# Altium project ESCV03.PrjPcb
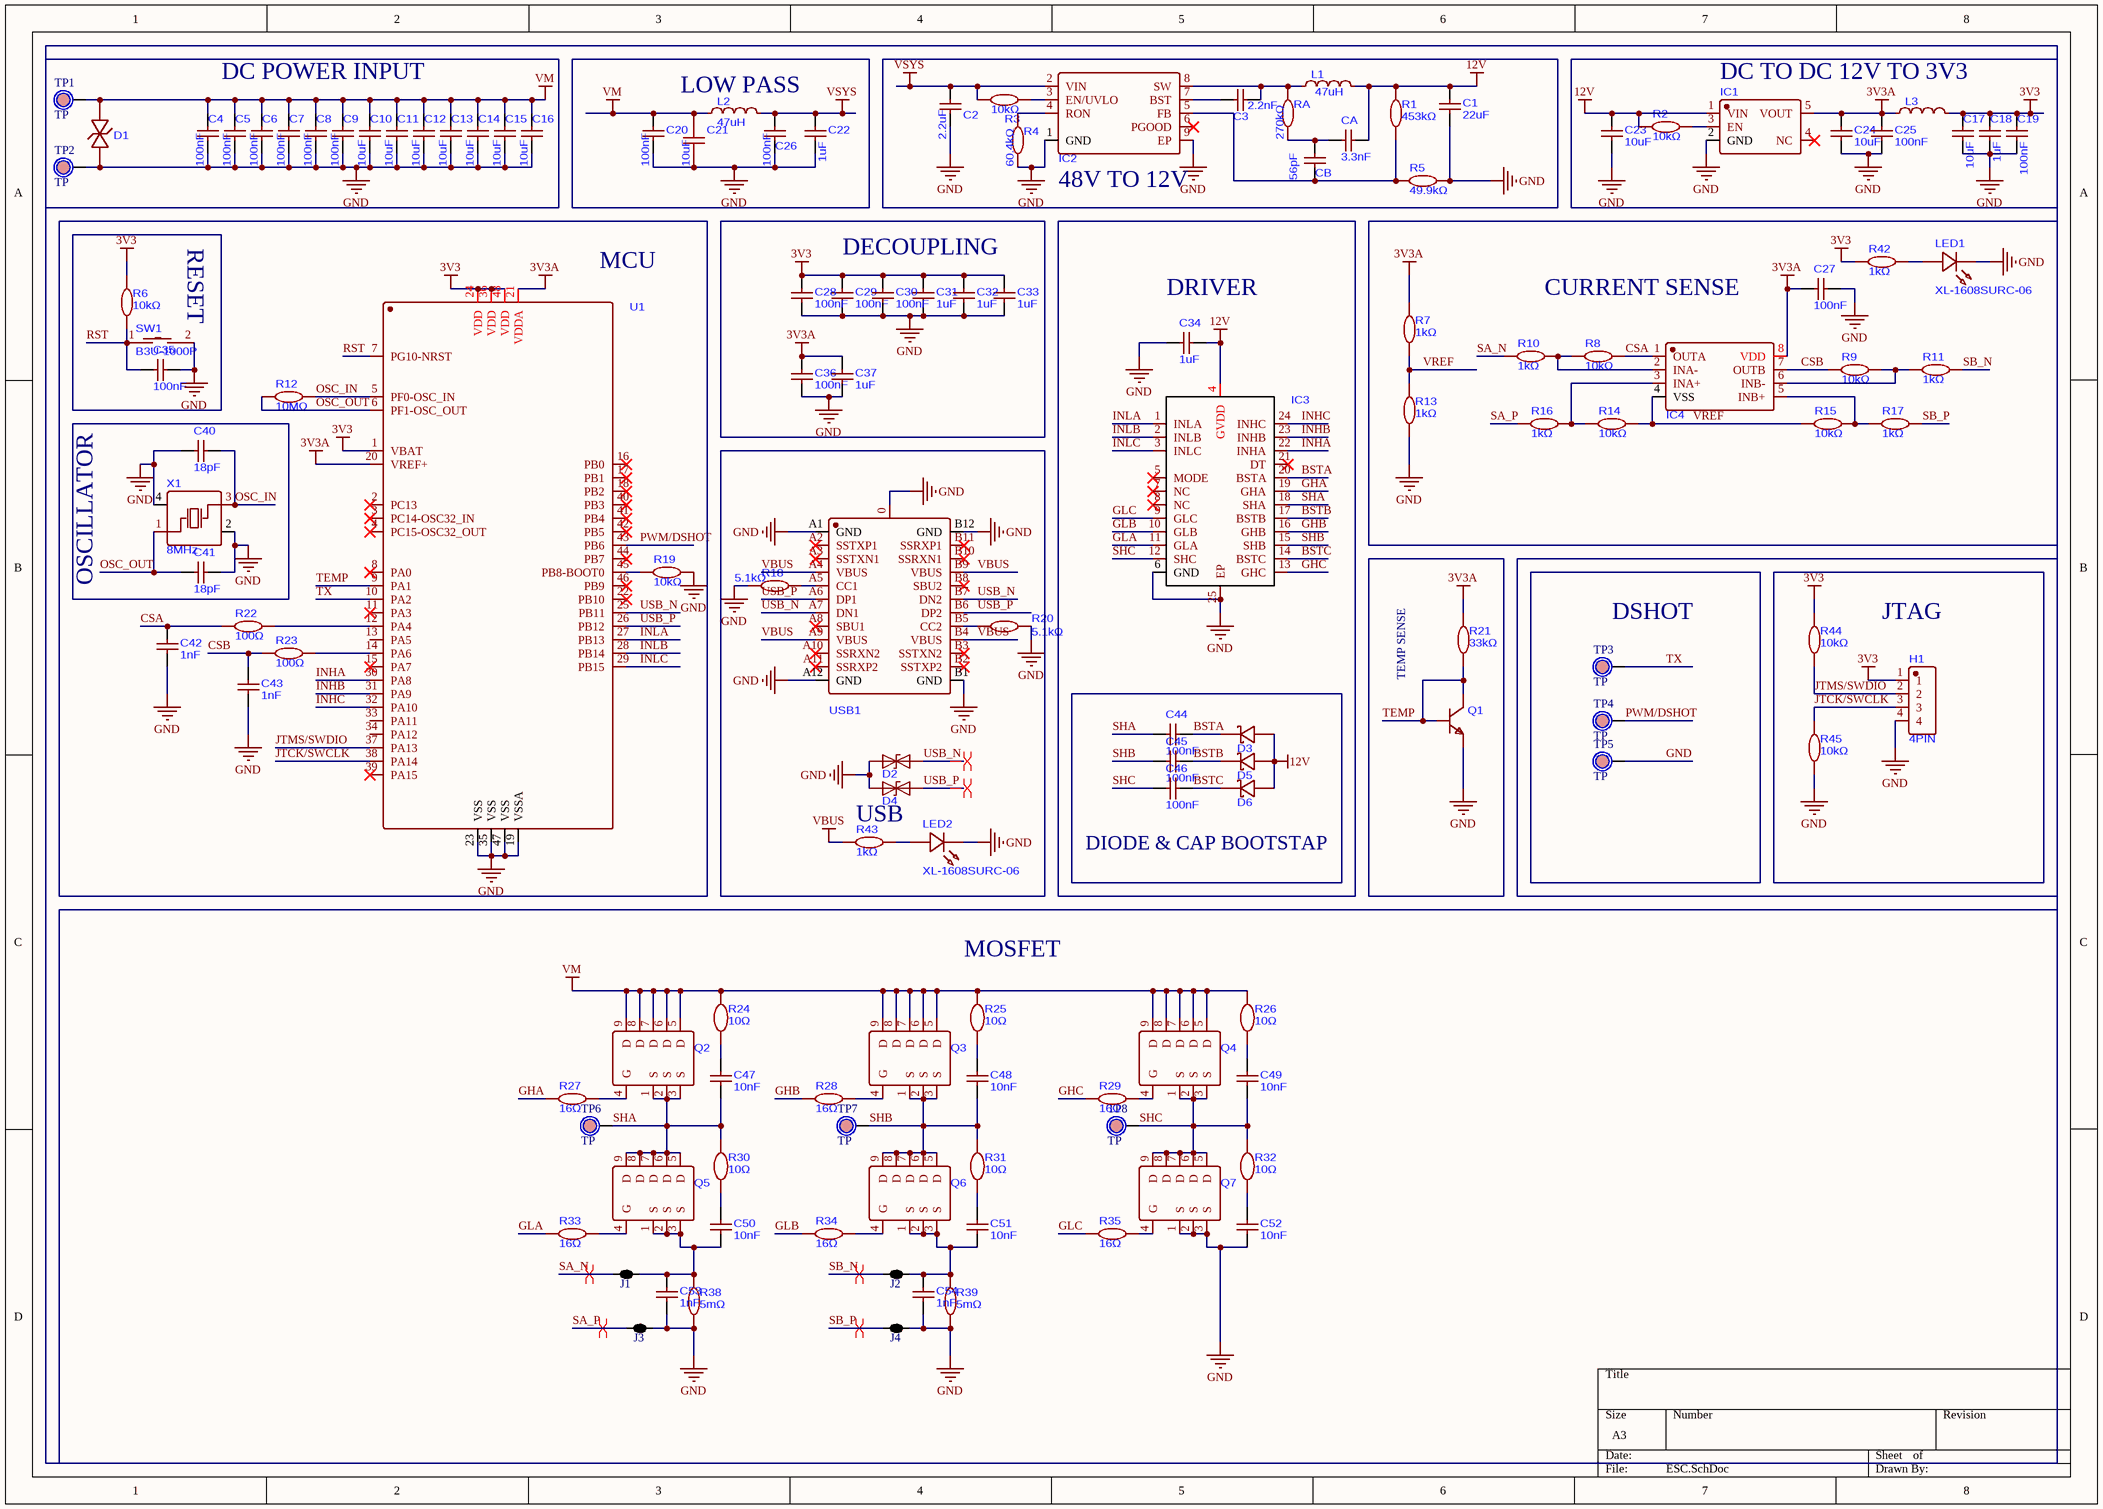
[diagram p0: ESC.SchDoc]
1 sheet, 135 parts. Net scope: global (net labels, ports and power ports of the same name join across sheets).
Board file: ESC.PcbDoc

## Sheet ESC.SchDoc
size A3; SheetNumber: 1; SheetTotal: 1; SPICEModelCacheRRHQRJVO: <root> / <DocumentId>RRHQRJVO</DocumentId> / <CacheFrame Number="0"> / <Model Name="spx3819" Kind="CKT"> / <Text>.SUBCKT SPX3819 VIN VOUT GND EN / * PARAMETERS / .PARAM VREF=3.3 / .PARAM VDROP=0.34 / .PARAM ILIM=0.9 / .PARAM ROUT=0.05 / * Enable logic (EN &gt; 1V) / EEN VEN 0 VALUE = { V(EN) &gt; 1 } / * Regulator core (with dropout) / EREG VREG 0 VALUE = { V(VEN)*LIMIT(V(VIN)-VDROP, 0, VREF) } / * Output resistance / Rout VREG VOUT {ROUT} / * Current sense / Rsense VOUT VSENSE 0.01 / * Current limit clamp / GCLAMP VOUT 0 VALUE = { / IF(I(Rsense) &gt; ILIM, -(I(Rsense)-ILIM)*5, 0) / } / * Ground reference / RGND GND 0 1m / .ENDS SPX3819</Text> / </Model> / <Model Name="fb_220_adv" Kind="CKT"> / <Text>.SUBCKT FB_220_ADV 1 2 / Rdc 1 2 0.045 / * low freq inductive / L1 1 3 50n / R1 3 2 1 / * high freq loss / R2 1 2 200 / Cpar 1 2 2p / .ends FB_220_ADV</Text> / </Model> / <Model Name="mmbt3904" Kind="CKT"> / <Text>* SPICE model NPN bipolar transistor ***MMBT3904*** / * Use the symbol file ***mmbt3904.asy*** / * / * (c) Diotec Semiconductor AG / * www.diotec.com / * 2024-10-15 / * / ********************************************************* / * This model is for simulation purposes only. It does   * / * not replace reviewing of the data sheet nor real life * / * testing of the part inside the application.           * / ********************************************************* / * / .subckt MMBT3904 C  B  E  params: Vceo=40 Vcbo=60 Vebo=6 Ic=200m hfe=300 Ices=100n Vbe=700m ft=300Meg Ccbo=4p Cebo=8p Rc=1 Rb=.1 Re=.1 Eg=1.11 Xti=3 / * Above values are an example for the ***MMBT3904***. Using the / * above symbol file allows for direct insertion of other values / * according to these data sheet parameters: / * / * Vceo    	Collector Emitter voltage, Base open / * Vcbo		Collector Base voltage, Emitter open / * Vebo    	Emitter Base voltage, Collector open / * Ic		DC Collector current / * hfe		Max DC current gain / * Ices		Collector Emitter cut-off current / * Vbe		Min Base Emitter voltage / * ft		Gain bandwidth product / * Ccbo		Typ. Collector Base capacitance / * Cebo		Typ. Emitter Base capacitance / * Rc/Rb/Re	Fixed values / * / * Activation energy: Eg=1.11 for Si (npn) transistor / * Sat.-current temp. exp: Xti=3 for Si (npn) transistor / Q  C B E  Transistor / .model Transistor NPN(Is={Ices/2} Bf={hfe} Bvcbo={Vcbo} Bvbe={-Vebo} Vceo={Vceo} Vje={Vbe} Tf={1/(2*pi*ft)} Eg={Eg} Xti={Xti} Icrating={Ic} Cjc={Ccbo*2} Cje={Cebo*2} Rc={Rc} Rb={Rb} Re={Re} mfg=Diotec) / .ends</Text> / </Model> / </CacheFrame> / </root>

### Parts
C1  22uF  [C0603]
C2  2.2uF  [C0805]
C3  2.2nF  [C0402]
C4  100nF  [C0805]
C5  100nF  [C0805]
C6  100nF  [C0805]
C7  100nF  [C0805]
C8  100nF  [C0805]
C9  100nF  [C0805]
C10  10uF  [C1206]
C11  10uF  [C1206]
C12  10uF  [C1206]
C13  10uF  [C1206]
C14  10uF  [C1206]
C15  10uF  [C1206]
C16  10uF  [C1206]
C17  10uF  [C0603]
C18  1uF  [C0603]
C19  100nF  [C0603]
C20  100nF  [C0805]
C21  10uF  [C1206]
C22  1uF  [C0603]
C23  10uF  [C0603]
C24  10uF  [C0603]
C25  100nF  [C0603]
C26  100nF  [C0805]
C27  100nF  [C0402]
C28  100nF  [C0402]
C29  100nF  [C0402]
C30  100nF  [C0402]
C31  1uF  [C0402]
C32  1uF  [C0402]
C33  1uF  [C0402]
C34  1uF  [C0402]
C35  100nF  [C0402]
C36  100nF  [C0402]
C37  1uF  [C0402]
C40  18pF  [C0402]
C41  18pF  [C0402]
C42  1nF  [C0402]
C43  1nF  [C0402]
C44  100nF  [C0402]
C45  100nF  [C0402]
C46  100nF  [C0402]
C47  10nF  [C1206]
C48  10nF  [C1206]
C49  10nF  [C1206]
C50  10nF  [C1206]
C51  10nF  [C1206]
C52  10nF  [C1206]
C53  1nF  [C0402]
C54  1nF  [C0402]
CA  3.3nF  [C0603]
CB  56pF  [C0603]
D1  TVS DIODE 58VWM 85VC SMB  [DO-214AA_L4.4-W3.6-LS5.3-RD]  (value not drawn)
D2  TVS DIODE 5VWM 18.6VC SOD-523  [SOD-523_L1.2-W0.8-LS1.6-BI]  (value not drawn)
D3  DIODE SCHOTTKY 100V SOD-123FL  [SOD-123FL_L2.7-W1.8-LS3.8-RD]  (value not drawn)
D4  TVS DIODE 5VWM 18.6VC SOD-523  [SOD-523_L1.2-W0.8-LS1.6-BI]  (value not drawn)
D5  DIODE SCHOTTKY 100V SOD-123FL  [SOD-123FL_L2.7-W1.8-LS3.8-RD]  (value not drawn)
D6  DIODE SCHOTTKY 100V SOD-123FL  [SOD-123FL_L2.7-W1.8-LS3.8-RD]  (value not drawn)
H1  4PIN  [HDR-TH_4P-P1.27-V-M]
IC1  500mA Low-Noise LDo Voltage Regulator  [SOT-23-5_L2.9-W1.6-P0.95-LS2.8-BR]  (value not drawn)
IC2  100-V Input, 1-A Synchronous Buck DC/DC Converter  [SO-8_L4.9-W3.9-P1.27-LS6.0-BL-EP]  (value not drawn)
IC3  100V three-phase BLDC gate driver  [QFN-24_L4.0-W4.0-P0.50-BL-EP2.7]  (value not drawn)
IC4  Zero-Drift CMOS Rail-to-Rail I/O Opamp with RF Filter  [MSOP-8_L3.0-W3.0-P0.65-LS5.0-BL]  (value not drawn)
J1  2 way net tie junction  [2way_LP]  (value not drawn)  (net tie, no BOM)
J2  2 way net tie junction  [2way_LP]  (value not drawn)  (net tie, no BOM)
J3  2 way net tie junction  [2way_LP]  (value not drawn)  (net tie, no BOM)
J4  2 way net tie junction  [2way_LP]  (value not drawn)  (net tie, no BOM)
L1  47uH  [IND-SMD_L6.0-W6.0]
L2  47uH  [IND-SMD_L5.0-W5.0_FNR50XXS]
L3  FERRITE BEAD 120Ω 0603 1LN  [C0603]  (value not drawn)
LED1  XL-1608SURC-06  [LED0603-RD_RED]
LED2  XL-1608SURC-06  [LED0603-RD_RED]
Q1  TRANS NPN 40V 200mA SOT-416  [SC-75-3_L1.6-W0.8-P1.00-LS1.6-BR]  (value not drawn)
Q2  MOSFET N-CH 85V 170A PDFN5x6-8L  [PDFN-8_L5.8-W5.1-P1.27-LS6.1-BL]  (value not drawn)
Q3  MOSFET N-CH 85V 170A PDFN5x6-8L  [PDFN-8_L5.8-W5.1-P1.27-LS6.1-BL]  (value not drawn)
Q4  MOSFET N-CH 85V 170A PDFN5x6-8L  [PDFN-8_L5.8-W5.1-P1.27-LS6.1-BL]  (value not drawn)
Q5  MOSFET N-CH 85V 170A PDFN5x6-8L  [PDFN-8_L5.8-W5.1-P1.27-LS6.1-BL]  (value not drawn)
Q6  MOSFET N-CH 85V 170A PDFN5x6-8L  [PDFN-8_L5.8-W5.1-P1.27-LS6.1-BL]  (value not drawn)
Q7  MOSFET N-CH 85V 170A PDFN5x6-8L  [PDFN-8_L5.8-W5.1-P1.27-LS6.1-BL]  (value not drawn)
R1  453kΩ  [R0603]
R2  10kΩ  [R0603]
R3  10kΩ  [R0603]
R4  60.4kΩ  [R0603]
R5  49.9kΩ  [R0603]
R6  10kΩ  [R0402]
R7  1kΩ  [R0402]
R8  10kΩ  [R0402]
R9  10kΩ  [R0402]
R10  1kΩ  [R0402]
R11  1kΩ  [R0402]
R12  10MΩ  [R0402]
R13  1kΩ  [R0402]
R14  10kΩ  [R0402]
R15  10kΩ  [R0402]
R16  1kΩ  [R0402]
R17  1kΩ  [R0402]
R18  5.1kΩ  [R0402]
R19  10kΩ  [R0402]
R20  5.1kΩ  [R0402]
R21  33kΩ  [R0402]
R22  100Ω  [R0402]
R23  100Ω  [R0402]
R24  10Ω  [R0612]
R25  10Ω  [R0612]
R26  10Ω  [R0612]
R27  16Ω  [R0402]
R28  16Ω  [R0402]
R29  16Ω  [R0402]
R30  10Ω  [R0612]
R31  10Ω  [R0612]
R32  10Ω  [R0612]
R33  16Ω  [R0402]
R34  16Ω  [R0402]
R35  16Ω  [R0402]
R38  5mΩ  [R2512]
R39  5mΩ  [R2512]
R42  1kΩ  [R0402]
R43  1kΩ  [R0402]
R44  10kΩ  [R0402]
R45  10kΩ  [R0402]
RA  270kΩ  [R0603]
SW1  B3U-1000P  [KEY-SMD_B3U-1000PM]
TP1  TP  [PAD]
TP2  TP  [PAD]
TP3  TP  [PAD]
TP4  TP  [PAD]
TP5  TP  [PAD]
TP6  TP  [PAD]
TP7  TP  [PAD]
TP8  TP  [PAD]
U1  Arm Cortex-M4 32-bit MCU+FPU, 170 MHz / 213 DMIPS, up to 128 KB Flash, 32 KB SRAM, rich analog, math accelerator  [LQFP-48_L7.0-W7.0-P0.50-LS9.0-BL]  (value not drawn)
USB1  CONN RCPT Type-C 24POS SMD  [USB-C-SMD_U263-241N-4BQC14]  (value not drawn)
X1  8MHz  [OSC-SMD_4P-L5.0-W3.2-BL]

### Nets
3V3: C17.2 C18.2 C19.2 C28.2 C29.2 C30.2 C31.2 C32.2 C33.2 H1.1 L3.2 R6.2 R42.1 R44.2 U1.1(VBAT) U1.24(VDD) U1.36(VDD) U1.48(VDD)
3V3A: C24.2 C25.2 C27.2 C36.2 C37.2 IC1.5(VOUT) IC4.8(VDD) L3.1 R7.2 R21.2 U1.20(VREF+) U1.21(VDDA)
12V: C1.2 C23.2 C34.2 CA.2 D3.2 D5.2 D6.2 IC1.1(VIN) IC3.4(GVDD) L1.2 R1.2 R2.1
GND: C1.1 C2.1 C4.1 C5.1 C6.1 C7.1 C8.1 C9.1 C10.1 C11.1 C12.1 C13.1 C14.1 C15.1 C16.1 C17.1 C18.1 C19.1 C20.1 C21.1 C22.1 C23.1 C24.1 C25.1 C26.1 C27.1 C28.1 C29.1 C30.1 C31.1 C32.1 C33.1 C34.1 C35.2 C36.1 C37.1 C40.1 C41.2 C42.1 C43.1 C52.1 C53.1 C54.1 D1.1 D2.1(K) D4.1(K) H1.4 IC1.2(GND) IC2.1(GND) IC2.9(EP) IC3.6(GND) IC3.25(EP) J3.2 J4.2 LED1.1(K) LED2.1(K) Q1.2(E) Q7.1(S) Q7.2(S) Q7.3(S) R4.1 R5.2 R13.1 R18.1 R19.2 R20.2 R38.1 R39.1 R45.1 SW1.2 TP2.1 TP5.1 U1.19(VSSA) U1.23(VSS) U1.35(VSS) U1.47(VSS) USB1.0(SHELL) USB1.A1(GND) USB1.A12(GND) USB1.B1(GND) USB1.B12(GND) X1.2(GND) X1.4(GND)
VBUS: R43.1 USB1.A4(VBUS) USB1.A9(VBUS) USB1.B4(VBUS) USB1.B9(VBUS)
VM: C4.2 C5.2 C6.2 C7.2 C8.2 C9.2 C10.2 C11.2 C12.2 C13.2 C14.2 C15.2 C16.2 C20.2 C21.2 D1.2 L2.1 Q2.5(D) Q2.6(D) Q2.7(D) Q2.8(D) Q2.9(D) Q3.5(D) Q3.6(D) Q3.7(D) Q3.8(D) Q3.9(D) Q4.5(D) Q4.6(D) Q4.7(D) Q4.8(D) Q4.9(D) R24.2 R25.2 R26.2 TP1.1
VSYS: C2.2 C22.2 C26.2 IC2.2(VIN) L2.2 R3.1
BSTA: C44.2 D3.1 IC3.20(BSTA)
BSTB: C45.2 D5.1 IC3.17(BSTB)
BSTC: C46.2 D6.1 IC3.14(BSTC)
CSA: C42.2 IC4.1(OUTA) R8.2 R22.1
CSB: C43.2 IC4.7(OUTB) R9.1 R23.1
GHA: IC3.19(GHA) R27.1
GHB: IC3.16(GHB) R28.1
GHC: IC3.13(GHC) R29.1
GLA: IC3.11(GLA) R33.1
GLB: IC3.10(GLB) R34.1
GLC: IC3.9(GLC) R35.1
INHA: IC3.22(INHA) U1.30(PA8)
INHB: IC3.23(INHB) U1.31(PA9)
INHC: IC3.24(INHC) U1.32(PA10)
INLA: IC3.1(INLA) U1.27(PB13)
INLB: IC3.2(INLB) U1.28(PB14)
INLC: IC3.3(INLC) U1.29(PB15)
JTCK/SWCLK: H1.3 R45.2 U1.38(PA14)
JTMS/SWDIO: H1.2 R44.1 U1.37(PA13)
OSC_IN: C40.2 R12.2 U1.5(PF0-OSC_IN) X1.3(OSC2)
OSC_OUT: C41.1 R12.1 U1.6(PF1-OSC_OUT) X1.1(OSC1)
PWM/DSHOT: TP4.1 U1.43(PB6)
RST: C35.1 R6.1 SW1.1 U1.7(PG10-NRST)
SA_N: J1.1 R10.1
SA_P: J3.1 R16.1
SB_N: J2.1 R11.2
SB_P: J4.1 R17.2
SHA: C44.1 C47.1 IC3.18(SHA) Q2.1(S) Q2.2(S) Q2.3(S) Q5.5(D) Q5.6(D) Q5.7(D) Q5.8(D) Q5.9(D) R30.2 TP6.1
SHB: C45.1 C48.1 IC3.15(SHB) Q3.1(S) Q3.2(S) Q3.3(S) Q6.5(D) Q6.6(D) Q6.7(D) Q6.8(D) Q6.9(D) R31.2 TP7.1
SHC: C46.1 C49.1 IC3.12(SHC) Q4.1(S) Q4.2(S) Q4.3(S) Q7.5(D) Q7.6(D) Q7.7(D) Q7.8(D) Q7.9(D) R32.2 TP8.1
TEMP: Q1.1(B) Q1.3(C) R21.1 U1.9(PA1)
TX: TP3.1 U1.10(PA2)
USB_N: D2.2(A) U1.25(PB11) USB1.A7(DN1) USB1.B7(DN2)
USB_P: D4.2(A) U1.26(PB12) USB1.A6(DP1) USB1.B6(DP2)
VREF: IC4.4(VSS) R7.1 R13.2 R14.2 R15.1
NetC3_1: C3.1 IC2.8(SW) L1.1 RA.2
NetC3_2: C3.2 IC2.7(BST)
NetC47_2: C47.2 R24.1
NetC48_2: C48.2 R25.1
NetC49_2: C49.2 R26.1
NetC50_1: C50.1 C53.2 J1.2 Q5.1(S) Q5.2(S) Q5.3(S) R38.2
NetC50_2: C50.2 R30.1
NetC51_1: C51.1 C54.2 J2.2 Q6.1(S) Q6.2(S) Q6.3(S) R39.2
NetC51_2: C51.2 R31.1
NetC52_2: C52.2 R32.1
NetCA_1: CA.1 CB.2 RA.1
NetCB_1: CB.1 IC2.5(FB) R1.1 R5.1
NetIC1_3: IC1.3(EN) R2.2
NetIC2_3: IC2.3(EN/UVLO) R3.2
NetIC2_4: IC2.4(RON) R4.2
NetIC4_2: IC4.2(INA-) R8.1 R10.2
NetIC4_3: IC4.3(INA+) R14.1 R16.2
NetIC4_5: IC4.5(INB+) R15.2 R17.1
NetIC4_6: IC4.6(INB-) R9.2 R11.1
NetLED1_2: LED1.2(A) R42.2
NetLED2_2: LED2.2(A) R43.2
NetQ2_4: Q2.4(G) R27.2
NetQ3_4: Q3.4(G) R28.2
NetQ4_4: Q4.4(G) R29.2
NetQ5_4: Q5.4(G) R33.2
NetQ6_4: Q6.4(G) R34.2
NetQ7_4: Q7.4(G) R35.2
NetR18_2: R18.2 USB1.A5(CC1)
NetR19_1: R19.1 U1.45(PB8-BOOT0)
NetR20_1: R20.1 USB1.B5(CC2)
NetR22_2: R22.2 U1.12(PA4)
NetR23_2: R23.2 U1.14(PA6)

Not connected (* = marked no-connect by the designer): IC1 4(NC)*; IC2 6(PGOOD)*; IC3 5(MODE)* 7(NC)* 8(NC)* 21(DT)*; U1 2(PC13)* 3(PC14-OSC32_IN)* 4(PC15-OSC32_OUT)* 8(PA0)* 11(PA3)* 13(PA5) 15(PA7)* 16(PB0)* 17(PB1)* 18(PB2)* 22(PB10)* 33(PA11) 34(PA12) 39(PA15)* 40(PB3)* 41(PB4)* 42(PB5)* 44(PB7)* 46(PB9)*; USB1 A2(SSTXP1)* A3(SSTXN1)* A8(SBU1)* A10(SSRXN2)* A11(SSRXP2)* B2(SSTXP2)* B3(SSTXN2)* B8(SBU2)* B10(SSRXN1)* B11(SSRXP1)*

### Layout directives
differential pair; differential pair class DIFF: SA_N, SA_P, SB_N, SB_P
differential pair; differential pair class DIFF90: USB_N, USB_P

### Notes on the sheet
- DC POWER INPUT
- (near L2) LOW PASS
- DC TO DC 12V TO 3V3
- RESET
- 48V TO 12V
- (near U1) MCU
- DECOUPLING
- (near C34) DRIVER
- CURRENT SENSE
- OSCILLATOR
- (near TP3) DSHOT
- JTAG
- TEMP SENSE
- USB
- DIODE & CAP BOOTSTAP
- (near R25) MOSFET

### Library data of the parts
C1 = GRM188C61E226ME01D: CAP CER 22uF 25V 0603
C2 = HHV0805R7225K101NSLJ: CAP CER 2.2uF 100V X7R 0805
C3 = GCM155R71H222KA37D: CAP CER 2.2nF 50V X7R 0402
C4-C9 C20 C26 = CL21B104KCFNNNE: 100nF ±10% 100V Ceramic Capacitor X7R 0805
C10-C16 C21 = C3216X6S2A106KT0A0E: 10uF X6S ±10% 100V 1206 Ceramic Capacitors RoHS
C17 C23 C24 = CL10A106MA8NRNC: CAP CER 10uF 25V X5R 0603
C18 C22 = GRM188D72A105KE01D: 1uF ±10% 100V Ceramic Capacitor X7T 0603
C19 C25 = CC0603KRX7R9BB104: 100nF ±10% 50V Ceramic Capacitor X7R 0603
C27-C30 C35 C36 C44-C46 = GRM155R71H104KE14D: CAP CER 100nF 50V X7R 0402
C31-C34 C37 = GRM155R61E105KA12D: CAP CER 1uF 25V X5R 0402
C40 C41 = CC0402FRNPO9BN180: CAP CER 18pF 50V NP0 0402
C42 C43 C53 C54 = CL05C102JB5NNNC: CAP CER 1nF 50V C0G 0402
C47-C52 = CC1206KRX7R0BB103: CAP CER 10nF 100V X7R 1206
CA = CL10B332KB8NNNC: CAP CER 3.3nF 50V X7R 0603
CB = CL10C560JB8NNNC: CAP CER 56pF 50V C0G 0603
D1 = ESSMBJ58C2H
D2 D4 = LESD5D5.0CT1G: 9.4A@8/20us 18.6V 7.8V 5V SOD-523 TVS Diodes RoHS
D3 D5 D6 = DSS110
H1 = PZ127V-11-04-0720: CONN HEADER 4POS 1.27mm SINGLE ROW TH
IC1 = SPX3819M5-L-3-3: 3.3V 16V Positive Fixed SOT-23-5 Voltage Regulators - Linear, Low Drop Out (LDO) Regulators RoHS
IC2 = LM5164DDAR
IC3 = DRV8300NRGER
IC4 = GS8592-MR
J1-J4 = 2way: ComponentLink1URL: http://www.edatools.cz/addons; ComponentLink1Description: Source; FootprintNote: LP=12mil, MP=40mil, HP=120mil
L1 = SRN6045TA-470M: FIXED IND 47uH 1.6A 200mΩ SMD,6x6mmSMD,5x5mm Fixed Inductors RoHS
L2 = FNR5040S470MT: 1.15A 47uH ±20% 1.2A 354mΩ Magnetic Shielded Inductor SMD,5x5mm Fixed Inductors RoHS
L3 = BLM18PG121SN1D
LED1 LED2 = XL-1608SURC-06: 20mA 2.3V Red 50mW 0603 LED Indication - Discrete ROHS
Q1 = MMBT3904TT1G: Bipolar (BJT) Transistor NPN 40V 200mA 300MHz 200mW Surface Mount SOT-416
Q2-Q7 = AGM028N08A
R1 = FRC0603F4533TS: RES 453kΩ ±1% 100mW 0603
R2 R3 = RC0603FR-0710KL: 100mW 10kΩ 75V ±100ppm/℃ Thick Film Resistor ±1% 0603 Chip Resistor - Surface Mount ROHS
R4 = FRC0603F6042TS: RES 60.4kΩ ±1% 100mW 0603
R5 = RC0603FR-0749K9L: 100mW 49.9kΩ 75V Thick Film Resistor ±100ppm/℃ ±1% 0603 Chip Resistor - Surface Mount RoHS
R6 R8 R9 R14 R15 R19 R44 R45 = RT0402BRD0710KL: RES 10kΩ ±0.1% 62.5mW 0402
R7 R10 R11 R13 R16 R17 R42 R43 = RT0402BRD071KL: RES 1kΩ ±0.1% 62.5mW 0402
R12 = FRC0402J105 TS: RES 1MΩ ±5% 62.5mW 0402
R18 R20 = RT0402BRD075K1L: RES 5.1kΩ ±0.1% 62.5mW 0402
R21 = FRC0402F3302TS: RES 33kΩ ±1% 62.5mW 0402
R22 R23 = RT0402BRD07100RL: RES 100Ω ±0.1% 62.5mW 0402
R24-R26 R30-R32 = WR121WF100JT5E: RES 10Ω ±1% 1W 0612
R27-R29 R33-R35 = ERJPA2J160X: RES 16Ω ±5% 200mW 0402
R38 R39 = RLP25FEGMR005: RES 5mΩ ±1% 3W 2512
RA = AR03BTCX2703: RES 270kΩ ±0.1% 100mW 0603
SW1 = B3U-1000P: 12V 2.5mm Round Button 3mm SPST 50mA SMD,3x2.5mm Tactile Switches ROHS
TP1-TP8 = Test_point_DNM: Test Point; Value: Test Point
U1 = STM32G431CBT6
USB1 = U263-241N-4BQC14
X1 = ABM3B-8.000MHZ-10-1-U-T: Crystal 8MHz ±10ppm 10pF 200Ω SMD5032-4P